# EAGLE design Helicopter Control Board2 (EAGLE 6.5.1)
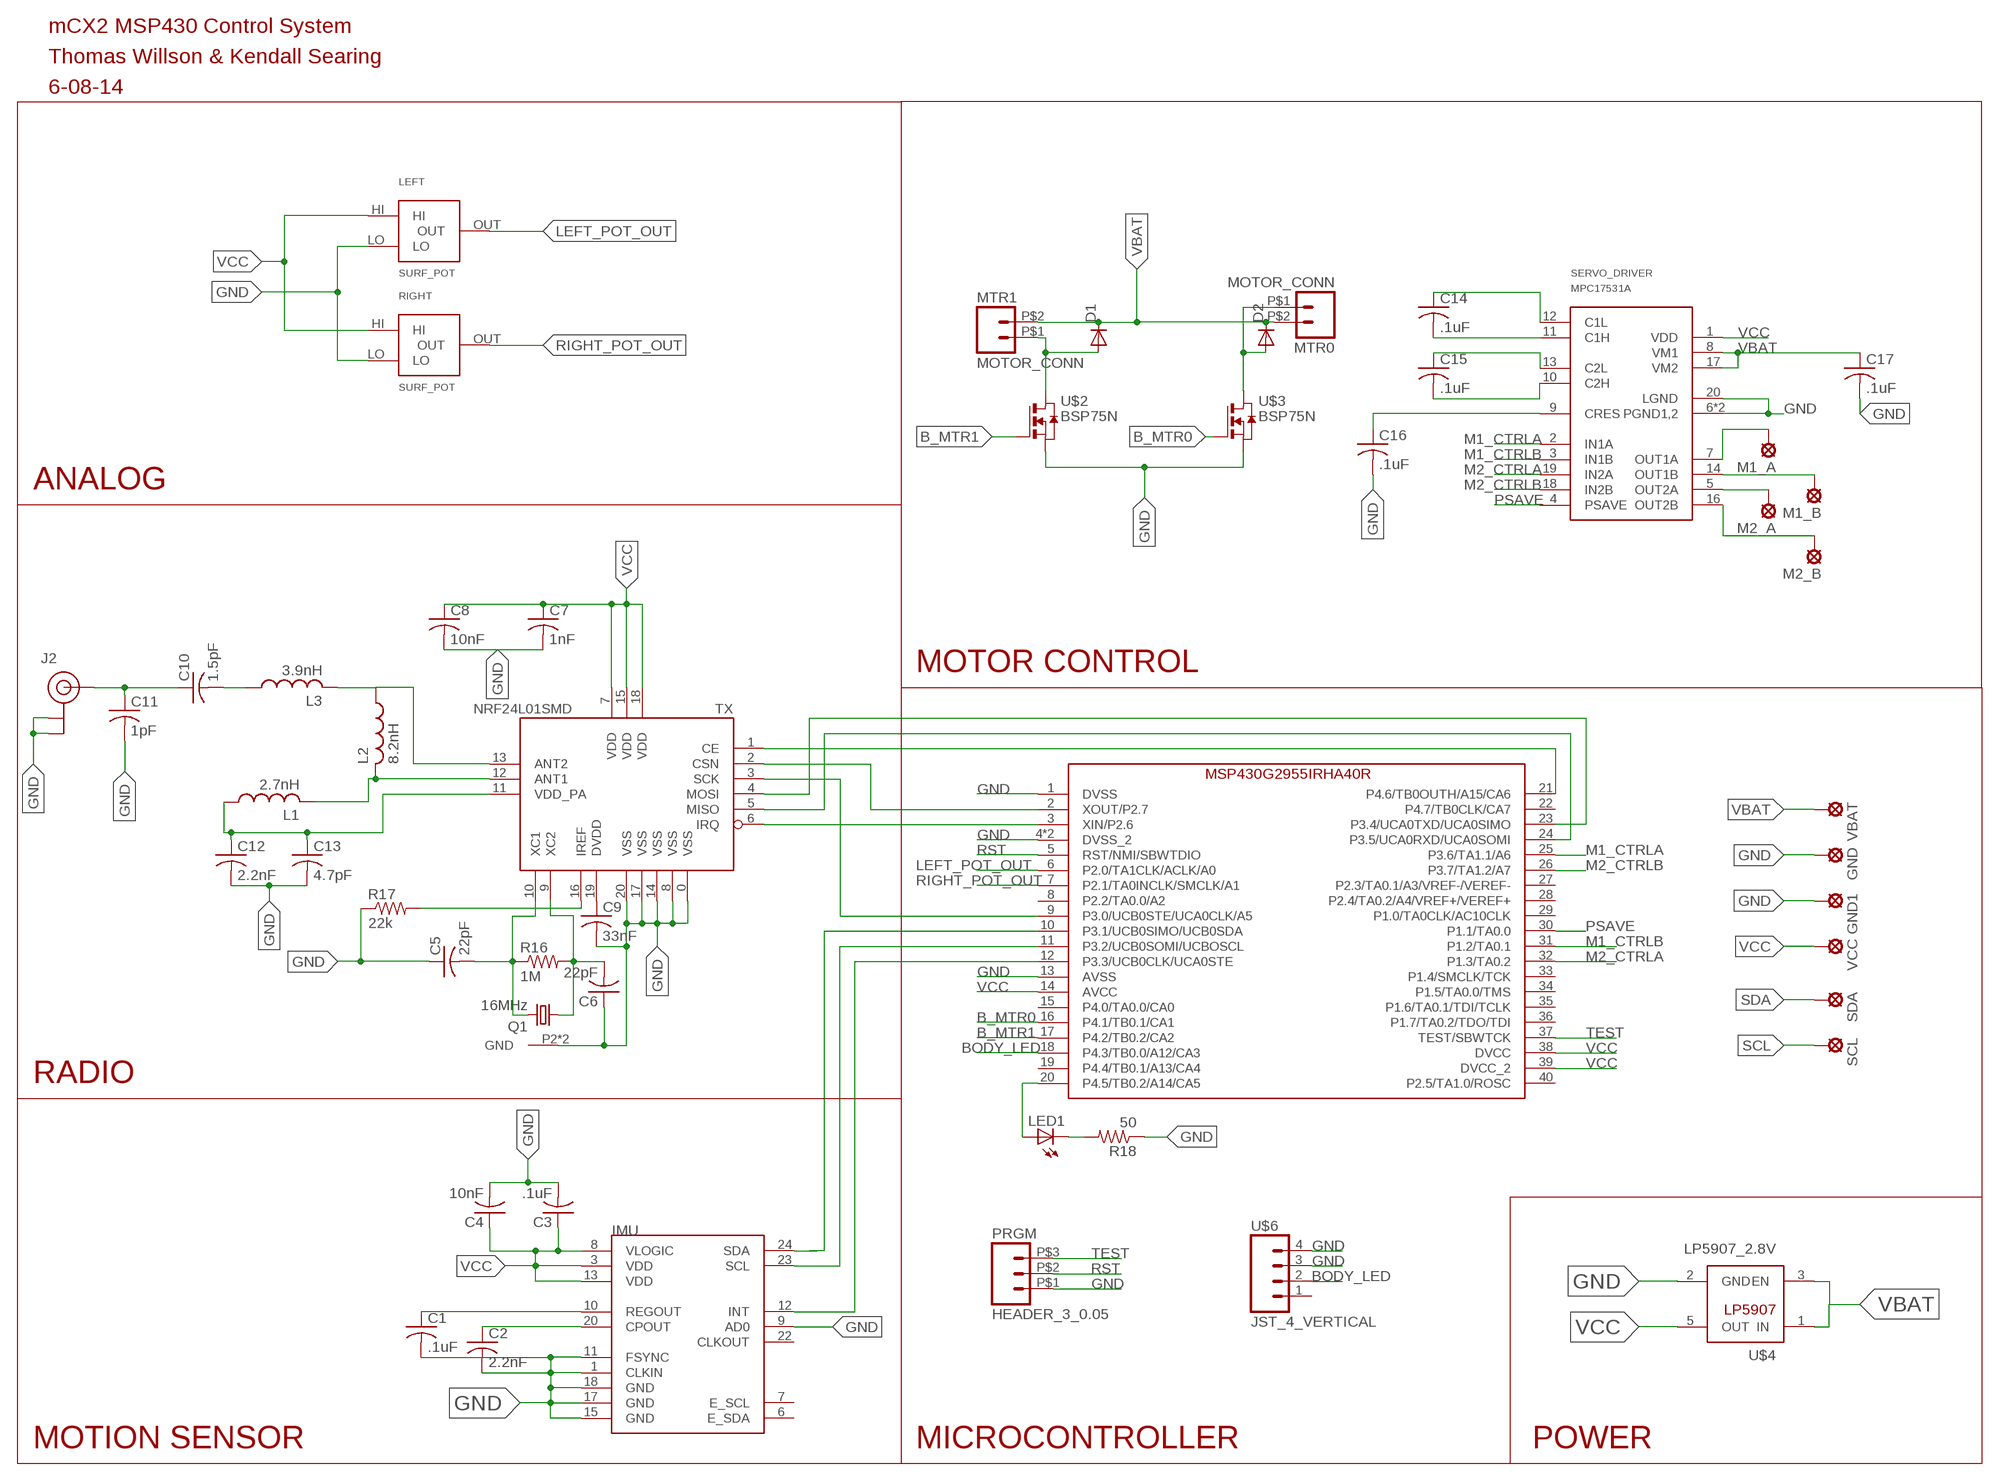
[diagram p0: schematic, sheet 1]

## Parts
C1  .1uF  C-USC0402  [C0402]
C2  2.2nF  C-USC0402  [C0402]
C3  .1uF  C-USC0402  [C0402]
C4  10nF  C-USC0402  [C0402]
C5  22pF  C-USC0402  [C0402]
C6  22pF  C-USC0402  [C0402]
C7  1nF  C-USC0402  [C0402]
C8  10nF  C-USC0402  [C0402]
C9  33nF  C-USC0402  [C0402]
C10  1.5pF  C-USC0402  [C0402]
C11  1pF  C-USC0402  [C0402]
C12  2.2nF  C-USC0402  [C0402]
C13  4.7pF  C-USC0402  [C0402]
C14  .1uF  C-USC0402  [C0402]
C15  .1uF  C-USC0402  [C0402]
C16  .1uF  C-USC0402  [C0402]
C17  .1uF  C-USC0402  [C0402]
D1  DIODESMA  [SMA-DIODE]
D2  DIODESMA  [SMA-DIODE]
GND  LSP10  [LSP10]
GND1  LSP10  [LSP10]
IMU  MPU-9150QFN-24-NP  [QFN-24-NP]
J2  U.FL  [U.FL]
L1  2.7nH  L-US  [R0402]
L2  8.2nH  L-US  [R0402]
L3  3.9nH  L-US  [R0402]
LED1  LED-BLUE0603  [LED-0603]
LEFT  SURF_POT  [SURF_POT]
M1_A  LSP10  [LSP10]
M1_B  LSP10  [LSP10]
M2_A  LSP10  [LSP10]
M2_B  LSP10  [LSP10]
MTR0  MOTOR_CONN  [MOTOR_CONN]
MTR1  MOTOR_CONN  [MOTOR_CONN]
PRGM  HEADER_3_0.05  [HEADER_3_.05]
Q1  16MHz  CRYSTAL_16MHZ_12PF_SMD  [TXC-4SMD]
R16  1M  R-US_R0402  [R0402]
R17  22k  R-US_R0402  [R0402]
R18  50  R-US_R0603  [R0603]
RIGHT  SURF_POT  [SURF_POT]
SCL  LSP10  [LSP10]
SDA  LSP10  [LSP10]
SERVO_DRIVER  MPC17531A  [SSOP_20]
TX  NRF24L01SMD  [QFN20]
U$2  BSP75N  [PG-SOT-223]
U$3  BSP75N  [PG-SOT-223]
U$4  LP5907_2.8V  LP5907  [SOT23-DBV]
U$6  JST_4_VERTICAL  [JST-4-SMD-VERT-1.0MM]
U$8  G2955IRHA40R  [RHA40]
VBAT  LSP10  [LSP10]
VCC  LSP10  [LSP10]

## Nets
AI: LED1.A U$8.20(P4.5/TB0.2/A14/CA5)
B_MTR0: U$3.1(G) U$8.16(P4.1/TB0.1/CA1)
B_MTR1: U$2.1(G) U$8.17(P4.2/TB0.2/CA2)
BODY_LED: U$6.2 U$8.18(P4.3/TB0.0/A12/CA3)
CE: TX.1(CE) U$8.21(P4.6/TB0OUTH/A15/CA6)
CSN: TX.2(CSN) U$8.2(XOUT/P2.7)
GND: C1.2 C2.2 C3.2 C4.2 C5.1 C6.1 C7.2 C8.2 C9.2 C11.2 C12.2 C13.2 C16.2 C17.2 GND1.MP GND.MP IMU.1(CLKIN) IMU.9(AD0) IMU.11(FSYNC) IMU.15(GND) IMU.17(GND) IMU.18(GND) J2.P$1(GND) J2.P$2(GND) LEFT.LO PRGM.P$1 Q1.P2(GND) Q1.P4(GND) R17.1 R18.1 RIGHT.LO SERVO_DRIVER.6(PGND1,2) SERVO_DRIVER.15(PGND1,2) SERVO_DRIVER.20(LGND) TX.0(VSS) TX.8(VSS) TX.14(VSS) TX.17(VSS) TX.20(VSS) U$2.3(S) U$2.4(S) U$3.3(S) U$3.4(S) U$4.2(GND) U$6.3 U$6.4 U$8.1(DVSS) U$8.4(DVSS_2) U$8.13(AVSS) U$8.TP(DVSS_2)
IRQ: TX.6(IRQ) U$8.3(XIN/P2.6)
LEFT_POT_OUT: LEFT.OUT U$8.6(P2.0/TA1CLK/ACLK/A0)
M1_CTRLA: SERVO_DRIVER.2(IN1A) U$8.25(P3.6/TA1.1/A6)
M1_CTRLB: SERVO_DRIVER.3(IN1B) U$8.31(P1.2/TA0.1)
M2_CTRLA: SERVO_DRIVER.19(IN2A) U$8.32(P1.3/TA0.2)
M2_CTRLB: SERVO_DRIVER.18(IN2B) U$8.26(P3.7/TA1.2/A7)
MISO: TX.5(MISO) U$8.24(P3.5/UCA0RXD/UCA0SOMI)
MOSI: TX.4(MOSI) U$8.23(P3.4/UCA0TXD/UCA0SIMO)
N$1: M1_A.MP SERVO_DRIVER.7(OUT1A)
N$3: M1_B.MP SERVO_DRIVER.14(OUT1B)
N$7: M2_A.MP SERVO_DRIVER.5(OUT2A)
N$8: IMU.12(INT) U$8.12(P3.3/UCB0CLK/UCA0STE)
N$10: C1.1 IMU.10(REGOUT)
N$11: C2.1 IMU.20(CPOUT)
N$12: M2_B.MP SERVO_DRIVER.16(OUT2B)
N$13: C14.1 SERVO_DRIVER.12(C1L)
N$14: C14.2 SERVO_DRIVER.11(C1H)
N$15: C15.1 SERVO_DRIVER.13(C2L)
N$17: C10.2 L3.1
N$18: D1.A MTR1.P$1 U$2.2(D)
N$19: D2.A MTR0.P$1 U$3.2(D)
N$21: C6.2 Q1.P1 R16.2 TX.9(XC2)
N$22: C5.2 Q1.P3 R16.1 TX.10(XC1)
N$23: C9.1 TX.19(DVDD)
N$24: R17.2 TX.16(IREF)
N$25: L1.2 L2.2 TX.12(ANT1)
N$26: C12.1 C13.1 L1.1 TX.11(VDD_PA)
N$27: L2.1 L3.2 TX.13(ANT2)
N$28: C10.1 C11.1 J2.P$3(SIGNAL)
N$30: C15.2 SERVO_DRIVER.10(C2H)
N$32: LED1.C R18.2
N$33: C16.1 SERVO_DRIVER.9(CRES)
PSAVE: SERVO_DRIVER.4(PSAVE) U$8.30(P1.1/TA0.0)
RIGHT_POT_OUT: RIGHT.OUT U$8.7(P2.1/TA0INCLK/SMCLK/A1)
RST: PRGM.P$2 U$8.5(RST/NMI/SBWTDIO)
SCK: TX.3(SCK) U$8.9(P3.0/UCB0STE/UCA0CLK/A5)
SCL: IMU.23(SCL) SCL.MP U$8.11(P3.2/UCB0SOMI/UCBOSCL)
SDA: IMU.24(SDA) SDA.MP U$8.10(P3.1/UCB0SIMO/UCB0SDA)
TEST: PRGM.P$3 U$8.37(TEST/SBWTCK)
VBAT: C17.1 D1.C D2.C MTR0.P$2 MTR1.P$2 SERVO_DRIVER.8(VM1) SERVO_DRIVER.17(VM2) U$4.1(IN) U$4.3(EN) VBAT.MP
VCC: C3.1 C4.1 C7.1 C8.1 IMU.3(VDD) IMU.8(VLOGIC) IMU.13(VDD) LEFT.HI RIGHT.HI SERVO_DRIVER.1(VDD) TX.7(VDD) TX.15(VDD) TX.18(VDD) U$4.5(OUT) U$8.14(AVCC) U$8.38(DVCC) U$8.39(DVCC_2) VCC.MP
Unconnected: IMU.6(E_SDA) IMU.7(E_SCL) IMU.22(CLKOUT) U$6.1 U$8.8(P2.2/TA0.0/A2) U$8.15(P4.0/TA0.0/CA0) U$8.19(P4.4/TB0.1/A13/CA4) U$8.22(P4.7/TB0CLK/CA7) U$8.27(P2.3/TA0.1/A3/VREF-/VEREF-) U$8.28(P2.4/TA0.2/A4/VREF+/VEREF+) U$8.29(P1.0/TA0CLK/AC10CLK) U$8.33(P1.4/SMCLK/TCK) U$8.34(P1.5/TA0.0/TMS) U$8.35(P1.6/TA0.1/TDI/TCLK) U$8.36(P1.7/TA0.2/TDO/TDI) U$8.40(P2.5/TA1.0/ROSC)

## Notes on the sheet
- mCX2 MSP430 Control System
- Thomas Willson & Kendall Searing
- 6-08-14
- ANALOG
- MOTOR CONTROL
- RADIO
- MOTION SENSOR | MICROCONTROLLER | POWER

## Library data of the parts
C1-C17 = resistor:C-US: CAPACITOR, American symbol
D1 D2 = SparkFun-DiscreteSemi:DIODE: Diode These are standard reverse protection diodes and small signal diodes. SMA package can handle up to about 1A. SOD-323 can handle about 200mA. What the SOD-323 package when ordering, there are some mfgs out there that are 5-pin packages.
GND GND1 M1_A M1_B M2_A M2_B SCL SDA VBAT VCC = solpad:LSP10: SOLDER PAD drill 1.0 mm, distributor Buerklin, 12H555
IMU = SparkFun-Sensors:MPU-9150: 9DOF (3mag, 3accel, 3rotat). I2C interface.
J2 = SparkFun-Connectors:U.FL: SMD antenna connector- WRL-09144
L1-L3 = resistor:L-US: INDUCTOR, American symbol
LED1 = SparkFun-LED:LED-BLUE: Blue LEDs for production use Various blue LEDs stocked by SparkFun production 0603 - DIO-08575 Rebel - DIO-09553 1206 - DIO-09911; PROD_ID: DIO-08575; VALUE: BLUE
LEFT RIGHT = CPE329:SURF_POT
MTR0 MTR1 = CPE329:MOTOR_CONN
PRGM = CPE329:HEADER_3_0.05: S9014E-03-ND
Q1 = CPE329:CRYSTAL_16MHZ_12PF_SMD: 887-1723-1-ND
R16-R18 = resistor:R-US_: RESISTOR, American symbol
SERVO_DRIVER = freescale:MPC17531A
TX = SparkFun-RF:NRF24L01: 2.4GHz Low Power Transceiver This is the very popular, low cost, very low power RF transceiver from Nordic Semiconductor. Simple SPI interface. SKU: COM-00690
U$2 U$3 = infineon:BSP75N
U$4 = texas:LP5907
U$6 = SparkFun-Connectors:JST_4_VERTICAL: CONN HEADER SH 4POS TOP 1MM TIN DK: 455-1790-1-ND
U$8 = TI_MSP430_v16:G2955IRHA40R

## Board
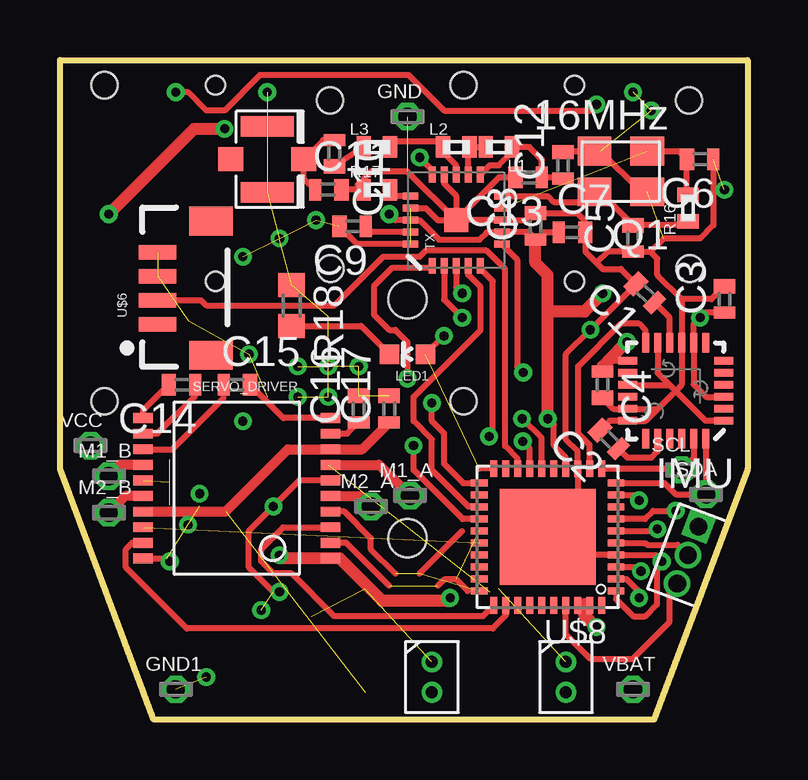
[diagram p1: board, top side]
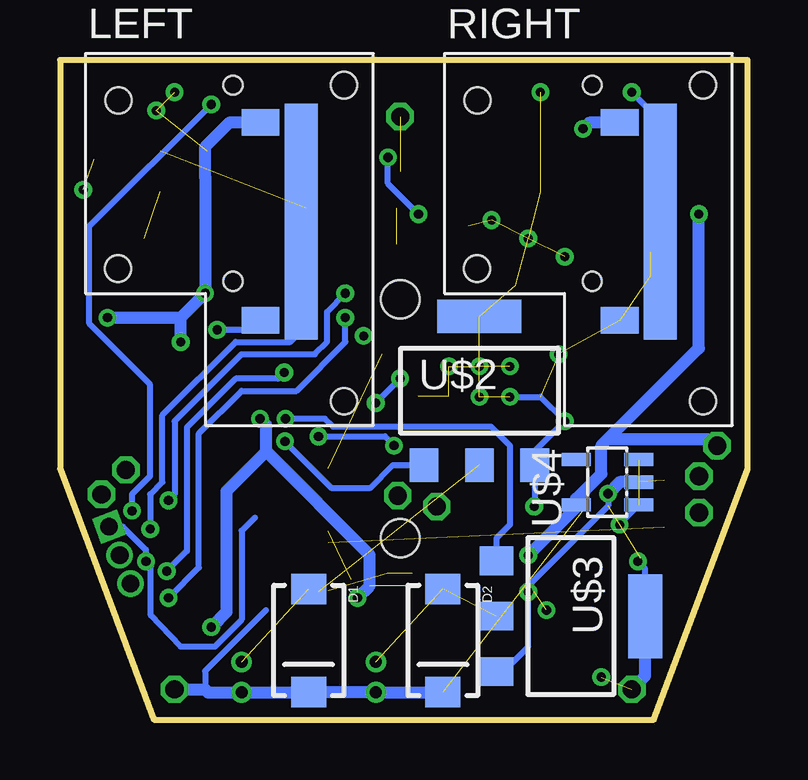
[diagram p2: board, bottom side, seen from below]

Size 28.65 x 27.51 mm. Coordinates in mm from the lower left corner, seen from the top.
Outline: 3.91,0 0,10.46 0,27.51 28.65,27.51 28.65,10.46 24.74,0 3.91,0
Copper layers (1*16): Top 0.0356mm / dielectric 1.5011mm / Bottom 0.0356mm
Design rules "OshPark DRC": minimum track width 6mil, minimum drill 13mil, track to track 6mil, track to pad 6mil, pad to pad 6mil, via to via 6mil, smd to smd 6mil, copper to edge 15mil, drill to drill 6mil, minimum pad ring 7mil, minimum via ring 7mil, stop-mask expansion 3mil, vias tented up to drill 0mil, thermal gap 10mil
Holes 1.6 mm at 14.48,17.53 14.48,7.57
tRestrict: 4 lines
bRestrict: 5 lines

### Footprints (pad centres in the part's own frame; a part is rotated, then mirrored left to right if it is on the bottom)
C0402 = smd 0.5 x 0.9: 1 -0.55,0 | smd 0.6 x 0.9: 2 0.55,0
SMA-DIODE = smd 1.27 x 1.47: A -2.15,0; C 2.15,0
LSP10 = drill 0.762 octagon: MP 0,0
QFN-24-NP = smd 0.8 x 0.3: 1 -2,1.25; 2 -2,0.75; 3 -2,0.25; 4 -2,-0.25; 5 -2,-0.75; 6 -2,-1.25; 13 2,-1.25; 14 2,-0.75; 15 2,-0.25; 16 2,0.25; 17 2,0.75; 18 2,1.25 | smd 0.3 x 0.8: 7 -1.25,-2; 8 -0.75,-2; 9 -0.25,-2; 10 0.25,-2; 11 0.75,-2; 12 1.25,-2; 19 1.25,2; 20 0.75,2; 21 0.25,2; 22 -0.25,2; 23 -0.75,2; 24 -1.25,2
U.FL = smd 2.2 x 0.85: P$1 0,1.375; P$2 0,-1.375 | smd 1.05 x 1: P$3 1.525,0; P$4 -1.525,0
R0402 = smd 0.6 x 0.9: 1 -0.55,0; 2 0.55,0
LED-0603 = smd 0.8 x 0.8: A 0,-0.75; C 0,0.75
SURF_POT = smd 1.575 x 1.092: HI -1.702,4.128; LO -1.702,-4.128 | smd 1.372 x 9.83: OUT 0,0 | hole 1.092: -7.62,5.042; -7.645,-1.968; 1.778,-7.493; 1.778,5.677 | hole 0.787: -2.845,5.677; -2.845,-2.502
MOTOR_CONN = drill 0.5 pad 0.813: P$1 -0.635,0; P$2 0.635,0
HEADER_3_.05 = drill 0.737 pad 1.067 square: P$1 -1.27,0 | drill 0.737 pad 1.067: P$2 0,0; P$3 1.27,0
TXC-4SMD = smd 1.4 x 1.2: P1 -1.1,-0.85; P2 1.1,-0.85; P3 1.1,0.85; P4 -1.1,0.85
R0603 = smd 1 x 1.1: 1 -0.85,0; 2 0.85,0
SSOP_20 = smd 0.813 x 0.406: 1 -3.9,2.925; 2 -3.9,2.275; 3 -3.9,1.625; 4 -3.9,0.975; 5 -3.9,0.325; 6 -3.9,-0.325; 7 -3.9,-0.975; 8 -3.9,-1.625; 9 -3.9,-2.275; 10 -3.9,-2.925; 11 3.9,-2.925; 12 3.9,-2.275; 13 3.9,-1.625; 14 3.9,-0.975; 15 3.9,-0.325; 16 3.9,0.325; 17 3.9,0.975; 18 3.9,1.625; 19 3.9,2.275; 20 3.9,2.925
QFN20 = smd 1 x 1: 0 0,0 | smd 0.65 x 0.3: 1 -1.9,1; 2 -1.9,0.5; 3 -1.9,0; 4 -1.9,-0.5; 5 -1.9,-1; 11 1.9,-1; 12 1.9,-0.5; 13 1.9,0; 14 1.9,0.5; 15 1.9,1 | smd 0.3 x 0.65: 6 -1,-1.9; 7 -0.5,-1.9; 8 0,-1.9; 9 0.5,-1.9; 10 1,-1.9; 16 1,1.9; 17 0.5,1.9; 18 0,1.9; 19 -0.5,1.9; 20 -1,1.9
PG-SOT-223 = smd 1.2 x 1.4: 1 -2.311,-3.099; 2 0,-3.099; 3 2.311,-3.099 | smd 3.5 x 1.4: 4 0,3.099
SOT23-DBV = smd 0.55 x 1.2: 1 -0.95,-1.3; 2 0,-1.3; 3 0.95,-1.3; 4 0.95,1.3; 5 -0.95,1.3
JST-4-SMD-VERT-1.0MM = smd 0.6 x 1.55: 1 -1.54,1.27; 2 -0.54,1.27; 3 0.46,1.27; 4 1.46,1.27 | smd 1.2 x 1.8: P$1 -2.84,-0.955; P$2 2.76,-0.955
RHA40 = smd 0.7 x 0.3: 1 -2.85,2.25; 2 -2.85,1.75; 3 -2.85,1.25; 4 -2.85,0.75; 5 -2.85,0.25; 6 -2.85,-0.25; 7 -2.85,-0.75; 8 -2.85,-1.25; 9 -2.85,-1.75; 10 -2.85,-2.25; 21 2.85,-2.25; 22 2.85,-1.75; 23 2.85,-1.25; 24 2.85,-0.75; 25 2.85,-0.25; 26 2.85,0.25; 27 2.85,0.75; 28 2.85,1.25; 29 2.85,1.75; 30 2.85,2.25 | smd 0.3 x 0.7: 11 -2.25,-2.85; 12 -1.75,-2.85; 13 -1.25,-2.85; 14 -0.75,-2.85; 15 -0.25,-2.85; 16 0.25,-2.85; 17 0.75,-2.85; 18 1.25,-2.85; 19 1.75,-2.85; 20 2.25,-2.85; 31 2.25,2.85; 32 1.75,2.85; 33 1.25,2.85; 34 0.75,2.85; 35 0.25,2.85; 36 -0.25,2.85; 37 -0.75,2.85; 38 -1.25,2.85; 39 -1.75,2.85; 40 -2.25,2.85 | smd 4 x 4: TP 0,0

### Placement (x,y rotation side)
C1  24.38,17.78 135 top
C2  22.89,11.69 135 top
C3  27.69,17.53 90 top
C4  22.61,13.97 270 top
C5  23.88,20.07 90 top
C6  26.67,23.37 180 top
C7  21.34,20.32 0 top
C8  19.81,20.57 90 top
C9  12.19,20.57 180 top
C10  11.43,23.62 270 top
C11  11.18,22.1 0 top
C12  20.95,23.11 90 top
C13  19.53,22.61 180 top
C14  5.08,13.97 180 top
C15  7.37,13.97 0 top
C16  12.45,12.95 90 top
C17  13.72,12.95 90 top
D1  18.29,3.3 270 bottom
D2  12.7,3.3 270 bottom
GND  14.48,25.15 0 top
GND1  4.83,1.27 0 top
IMU  25.65,13.72 180 top
J2  8.64,23.37 0 top
L1  18.29,23.88 180 top
L2  16.51,23.88 0 top
L3  13.21,23.88 0 top
LED1  14.48,15.24 90 top
LEFT  18.59,20.78 0 bottom
M1_A  14.58,9.35 0 top
M1_B  2.03,10.16 0 top
M2_A  12.95,8.89 0 top
M2_B  2.03,8.64 0 top
MTR0  15.49,1.78 270 top
MTR1  21.08,1.78 270 top
PRGM  26.16,6.86 249.5 top
Q1  23.37,22.86 180 top
R16  26.16,21.34 90 top
R17  13.21,22.1 0 top
R18  9.65,17.27 270 top
RIGHT  3.63,20.78 0 bottom
SCL  25.91,10.41 0 top
SDA  26.92,9.4 0 top
SERVO_DRIVER  7.37,9.65 180 top
TX  16.51,20.83 90 top
U$2  11.18,13.72 0 bottom
U$3  7.37,4.32 270 bottom
U$4  5.84,9.91 90 bottom
U$6  5.33,18.03 90 top
U$8  20.32,7.62 180 top
VBAT  23.88,1.27 0 top
VCC  1.27,11.43 0 top

### Tracks (layer width: path | path; a pad name or v marks a point on that pad's centre or on a via)
AI  (via drill 0.38)  (1 unrouted)
  Top 0.254: U$8.20 17.47,10.47 | LED1.A v15.99,16 v16,16
B_MTR0  (via drill 0.38)
  Top 0.254: U$8.16 20.07,10.42 arc-90 20.07,10.41 | U$8.16 | U$8.16 20.07,11.76 19.28,12.55 v19.25,12.55
  Bottom 0.254: U$3.1 10.46,7.57 9.91,8.13 9.91,11.43 10.69,12.22 17.27,12.22 17.6,12.55 v19.25,12.55
B_MTR1  (via drill 0.38)
  Top 0.254: U$8.17 19.57,11.32 v19.28,11.61
  Bottom 0.254: U$2.1 14.78,10.62 15.75,9.65 17.32,9.65 v19.28,11.61
BODY_LED
  Top 0.254: U$6.2 5.87,17.49 6.1,17.27 11.43,17.27 13.46,19.3 14.99,19.3 15.24,19.56 17.78,19.56 18.54,18.8 18.54,11.4 19.07,10.88 U$8.18
CE  (via drill 0.38)
  Top 0.254: U$8.21 16.8,9.87 16,10.67 16,11.94 15.49,12.45 v15.49,13.21 | TX.1 15.38,18.85 13.85,18.85 13.08,18.08 13.08,16.89 13.72,16.26 13.97,16.26 14.48,15.75 v14.48,14.22
  Bottom 0.254: v15.49,13.21 v14.48,14.22
CSN  (via drill 0.38)
  Top 0.254: TX.2 16.01,17.52 v16.76,16.76 | 23.2,5.84 U$8.2 23.59,5.87 24.13,5.33 v24.13,5.08
  Bottom 0.254: v16.76,16.76 16.76,15.75 18.8,13.72 21.08,13.72 22.86,11.94 22.86,6.35 v24.13,5.08
GND  (via drill 0.38)  (29 unrouted)
  Top 0.254: SERVO_DRIVER.20 4.45,6.73 v4.57,6.6 | R17.1 C11.2 | Q1.P4 24.22,22.01 22.52,23.71 Q1.P2 21,23.71 C12.2 | 24.6,19.52 25.15,20.07 26.67,20.07 27.22,20.62 C6.1 | v9.14,5.33 8.89,5.33 7.87,6.35 7.87,7.87 v8.89,8.89 9.98,9.98 SERVO_DRIVER.6 | 12.4,22.31 R17.1 | 25.9,17.53 IMU.9 25.9,13.97 25.65,13.72 | C13.2 18.29,22.61 TX.0 | TX.14 16,22.35 16.51,21.84 TX.0 | TX.17 15.25,21.33 15.75,20.83 TX.0 | 22.35,19.05 21.89,19.52 C7.2 21.84,20.36 21.84,20.83 21.55,21.12 C8.2 19.52,20.83 TX.8 TX.0 | 22.35,19.05 22.61,18.8 23.37,18.8 C1.2 24,18.15 v22.1,16.26 21.08,15.24 21.08,11.68 21.57,11.2 U$8.13 21.57,8.87 U$8.TP 21.07,6.87 U$8.4 24.8,6.87 v25.07,6.6 24.87,6.4 24.87,4.8 24.38,4.32 23.88,4.32 23.17,5.02 U$8.1 | 22.35,19.05 22.82,19.52 C5.1 24.6,19.52 | 25.9,17.53 24.89,18.54 24.89,19.22 24.6,19.52 | R17.1 12.66,22.56 12.95,22.86 14.48,22.86 TX.0 | IMU.1 26.9,12.47 25.65,13.72 | 24.9,12.97 24.4,12.47 IMU.18 22.89,12.47 C2.2 | 24.9,12.97 25.65,13.72 | IMU.11 24.9,14.47 25.4,13.97 | IMU.15 25.4,13.97 | 25.4,13.97 25.65,13.72 | 24.9,12.97 IMU.17 23.06,12.97 C4.2 | TX.20 12.39,19.83 C9.2 | C3.2 27.14,17.53 25.9,17.53
  Bottom 0.254: U$3.3 10.19,2.01 9.14,3.05 v9.14,5.33 9.14,5.59 5.82,8.91 v5.82,9.42 | v8.89,8.89 8.87,8.91 U$2.3 8.87,11.2 v7.62,12.45 8.64,13.46 v9.91,13.46 | 4.27,3.1 U$3.4 4.27,6.3 v4.57,6.6 | 20.34,16.7 LEFT.LO 20.69,16.26 v22.1,16.26 | 20.53,8.42 21.08,7.87 21.08,4.17 22.2,3.05 23.62,3.05 24.87,4.34 24.87,6.4 v25.07,6.6 25.07,7.08 26.04,8.05 PRGM.P$1
  Bottom 0.508: U$4.2 5.33,9.91 v5.82,9.42 | GND1.MP 4.27,1.83 U$3.4
  other vias: 12.45,14.73 11.18,14.73 9.91,14.73 11.18,13.46 7.62,19.3 10.67,20.83 23.88,26.16 27.69,22.1 8.38,4.57 6.1,1.78 8.64,26.16 9.14,20.07 7.87,15.24 24.64,25.4
  cutout Bottom (rank 6): 0,27.69 28.7,27.69 28.7,10.41 24.89,0 3.81,0 0,10.41
  cutout Top (rank 6): 0,27.69 28.7,27.69 28.7,10.41 24.89,0 3.81,0 0,10.41
IRQ  (via drill 0.38)
  Top 0.254: U$8.3 24.03,6.37 v24.21,6.2 | TX.6 19.05,19.19 19.05,14.73 v19.3,14.48
  Bottom 0.254: v19.3,14.48 19.56,14.22 21.34,14.22 23.37,12.19 23.37,7.04 v24.21,6.2
LEFT_POT_OUT  (via drill 0.38)
  Top 0.254: U$8.6 24.81,7.87 v24.89,7.95
  Bottom 0.254: LEFT.OUT 18.59,16.2 19.05,15.75 21.34,15.75 24.38,12.7 24.38,9.91 24.89,9.4 v24.89,7.95
M1_CTRLA  (2 unrouted)
  Top 0.254: 16.98,5.37 16.51,5.84 16,5.84 15.75,5.59 | 13.72,5.59 11.93,7.38 SERVO_DRIVER.2
M1_CTRLB
  Top 0.254: U$8.31 17.62,4.32 11.43,4.32 9.65,6.1 8.89,6.1 8.38,6.6 8.38,7.11 9.3,8.03 SERVO_DRIVER.3
M2_CTRLA
  Top 0.254: U$8.32 18.57,4.35 18.03,3.81 5.28,3.81 4.78,4.32 4.55,4.55 2.74,6.35 2.74,7.11 3.01,7.38 SERVO_DRIVER.19
M2_CTRLB  (1 unrouted)
MISO  (via drill 0.38)
  Top 0.254: U$8.24 16.78,8.37 14.73,10.41 v14.73,11.43 | TX.5 17.51,18.81 18.03,18.29 18.03,11.96 v17.88,11.81
  Bottom 0.254: v17.88,11.81 15.11,11.81 v14.73,11.43
MOSI
  Top 0.254: TX.4 17.01,18.55 17.53,18.03 17.53,16.26 14.73,13.46 14.73,12.45 15.49,11.68 15.49,10.41 17.02,8.89 17.45,8.89 U$8.23
N$1
  Top 0.406: SERVO_DRIVER.7 13.3,10.63 M1_A.MP
N$3
  Top 0.406: SERVO_DRIVER.14 2.5,10.63 M1_B.MP
N$7
  Top 0.406: SERVO_DRIVER.5 12.52,9.33 M2_A.MP
N$8
  Top 0.254: U$8.12 22.07,11.46 21.59,11.94 21.59,14.73 23.37,16.51 24.13,16.51 24.4,16.24 IMU.12
N$10
  Top 0.254: IMU.10 25.4,16.76 C1.1
N$11
  Top 0.254: IMU.20 24.89,11.7 24.89,11.18 24.64,10.92 23.65,10.92 C2.1
N$12
  Top 0.406: SERVO_DRIVER.16 2.72,9.33 M2_B.MP
N$13
  Top 0.254: SERVO_DRIVER.12 4.05,11.93 5.63,13.5 C14.1
N$14
  Top 0.254: SERVO_DRIVER.11 3.47,12.91 C14.2
N$15
  Top 0.254: SERVO_DRIVER.13 4.67,11.28 6.82,13.42 C15.1
N$17
  Top 0.254: L3.1 C10.2
N$18  (2 unrouted)
  Bottom 0.254: D1.A 17.9,5.33
  pour Bottom: 16.76,2.03 22.1,2.03 22.1,2.79 18.8,6.1 17.78,6.1 16.51,4.83 15.75,4.83 12.19,8.38 12.19,11.43 10.16,11.43 10.16,9.14 16.76,2.54
N$19  (2 unrouted)
  pour Bottom (rank 2): 9.65,3.81 10.41,3.81 11.43,2.79 11.43,2.03 16.51,2.03 16.51,2.54 12.95,6.1 12.19,6.1 11.18,5.08 9.65,5.08
N$21  (1 unrouted)
  Top 0.254: R16.2 26.12,21.93 C6.2 25.78,23.71 Q1.P1
N$22
  Top 0.254: Q1.P3 22.09,21.83 | TX.10 20.34,21.83 20.57,21.59 21.85,21.59 Q1.P3 | Q1.P3 22.48,22.01 C5.2 25.99,20.62 R16.1
N$23
  Top 0.254: TX.19 12.99,20.33 C9.1
N$24
  Top 0.254: TX.16 13.77,21.83 R17.2
N$25
  Top 0.254: TX.12 17.01,23.83 L2.2 L1.2
N$26
  Top 0.254: C12.1 20.91,22.61 C13.1 20.08,23.35 19.56,23.88 L1.1 18.84,23.66 18.29,23.11 17.9,23.11 TX.11
N$27
  Top 0.254: TX.13 16.51,23.11 15.96,23.66 L2.1 15.71,24.13 14.01,24.13 L3.2
N$28
  Top 0.254: C10.1 10.96,24.17 J2.P$3 10.16,22.56 C11.1
N$30
  Top 0.254: C15.2 9.31,12.58 SERVO_DRIVER.10
N$32
  Top 0.254: R18.2 12.55,16.42 LED1.C
N$33
  Top 0.254: SERVO_DRIVER.9 11.97,11.93 C16.1
PSAVE  (2 unrouted)
  Top 0.254: SERVO_DRIVER.4 11.85,8.68 12.95,7.57 12.95,7.11 13.97,6.1 | 14.99,6.1 16.76,7.87
RIGHT_POT_OUT  (via drill 0.38)
  Top 0.254: v4.83,26.16 5.33,26.16 6.1,25.4 6.86,25.4 8.33,26.87 14.53,26.87 16,25.4 22.1,25.4 v22.35,25.65 | U$8.7 24.37,8.37 24.71,8.71 v25.65,8.71
  Bottom 0.254: v22.35,25.65 27.43,20.57 27.43,16.51 24.89,13.97 24.89,10.16 25.65,9.4 v25.65,8.71 | v4.83,26.16 3.63,24.97 RIGHT.OUT
RST
  Top 0.254: U$8.5 24.38,7.37 24.46,7.29 25.73,7.29 PRGM.P$2
SCK  (via drill 0.38)
  Top 0.254: U$8.9 23.9,9.37 v24.13,9.14 | TX.3 16.51,18.03 v16.76,17.78
  Bottom 0.254: v24.13,9.14 23.88,9.4 23.88,12.45 21.08,15.24 18.03,15.24 17.53,15.75 17.53,17.02 v16.76,17.78
SCL
  Top 0.254: U$8.11 25.85,10.47 SCL.MP 26.4,10.91 IMU.23
SDA
  Top 0.254: U$8.10 25.18,9.87 25.65,9.4 SDA.MP 26.9,9.42 IMU.24
TEST
  Top 0.254: U$8.37 21.07,3.57 22.1,2.54 23.86,2.54 25.4,4.08 25.4,5.35 PRGM.P$3
VBAT  (via drill 0.38)  (2 unrouted)
  Top 0.406: C17.1 12.59,11.28 SERVO_DRIVER.8 9.5,11.28 6.9,8.68 5.33,8.68 | SERVO_DRIVER.17 5.33,8.68 | v5.33,8.13 5.33,8.68
  Bottom 0.254: 20.07,4.57 22.61,2.03 22.61,1.27 | U$4.1 5.33,8.16 v5.33,8.13
  Bottom 0.508: D2.C MTR0.P$2 D1.C MTR1.P$2 22.48,1.14 22.61,1.27 VBAT.MP
  pour Bottom (rank 3): 3.81,9.4 3.81,8.13 5.59,6.35 5.59,3.3 8.89,0 24.64,0 25.4,1.78 11.43,1.78 11.43,1.27 9.65,1.27 7.62,3.3 7.62,6.86 5.08,9.4
VCC  (via drill 0.38)
  Top 0.254: IMU.3 26.92,13.47 26.4,13.98 IMU.8 26.4,16.5 v26.67,16.76 26.88,16.98 C3.1 | U$8.39 U$8.38 21.63,4.83 21.84,4.83 | C7.1 20.11,20.32 C8.1 19.85,20.02 19.55,20.33 TX.7 17.78,20.32 17.48,20.02 15.8,20.02 14.99,20.83 TX.18 13.97,20.83 v13.72,21.08 | TX.15 15.51,22.92 v14.99,23.44 | U$8.14 21.07,10.93 20.57,11.43 20.57,12.29 v20.32,12.55 | IMU.13 22.88,14.97 22.86,14.99
  Top 0.508: v9.14,6.86 9.28,6.73 SERVO_DRIVER.1 11.65,6.73 13.42,4.95 16.13,4.95 v16.26,5.08 | v22.35,3.86 21.84,4.37 21.84,4.83 | v22.61,17.78 21.84,17.02 20.32,17.02 | v2.03,21.08 5.59,24.64 v6.86,24.64 | C4.1 22.61,14.73 22.86,14.99 v23.62,15.75 | v20.32,12.55 20.32,17.02 | 20.32,17.02 20.32,18.54 19.81,19.05 C8.1
  Bottom 0.254: LEFT.HI 20.31,24.91 | 22.59,22.61 22.61,22.61 | v13.72,21.08 14.99,22.35 v14.99,23.44
  Bottom 0.508: 5.84,11.68 6.1,11.43 6.1,10.26 7.14,9.21 U$4.5 7.14,8.86 v9.14,6.86 | 5.84,11.68 2.03,15.49 v2.03,21.08 | 22.61,22.61 v22.61,17.78 23.62,16.76 | 20.07,11.18 15.75,6.86 15.75,5.59 v16.26,5.08 | RIGHT.HI 5.35,24.89 6.6,24.89 v6.86,24.64 | v26.67,16.76 23.62,16.76 | v23.62,15.75 23.62,16.76 | 22.59,22.61 22.59,23.89 21.58,24.91 LEFT.HI | VCC.MP 1.52,11.68 5.84,11.68 | 20.07,11.18 20.07,12.29 v20.32,12.55 | v22.35,3.86 21.72,4.5 21.72,9.53 20.07,11.18